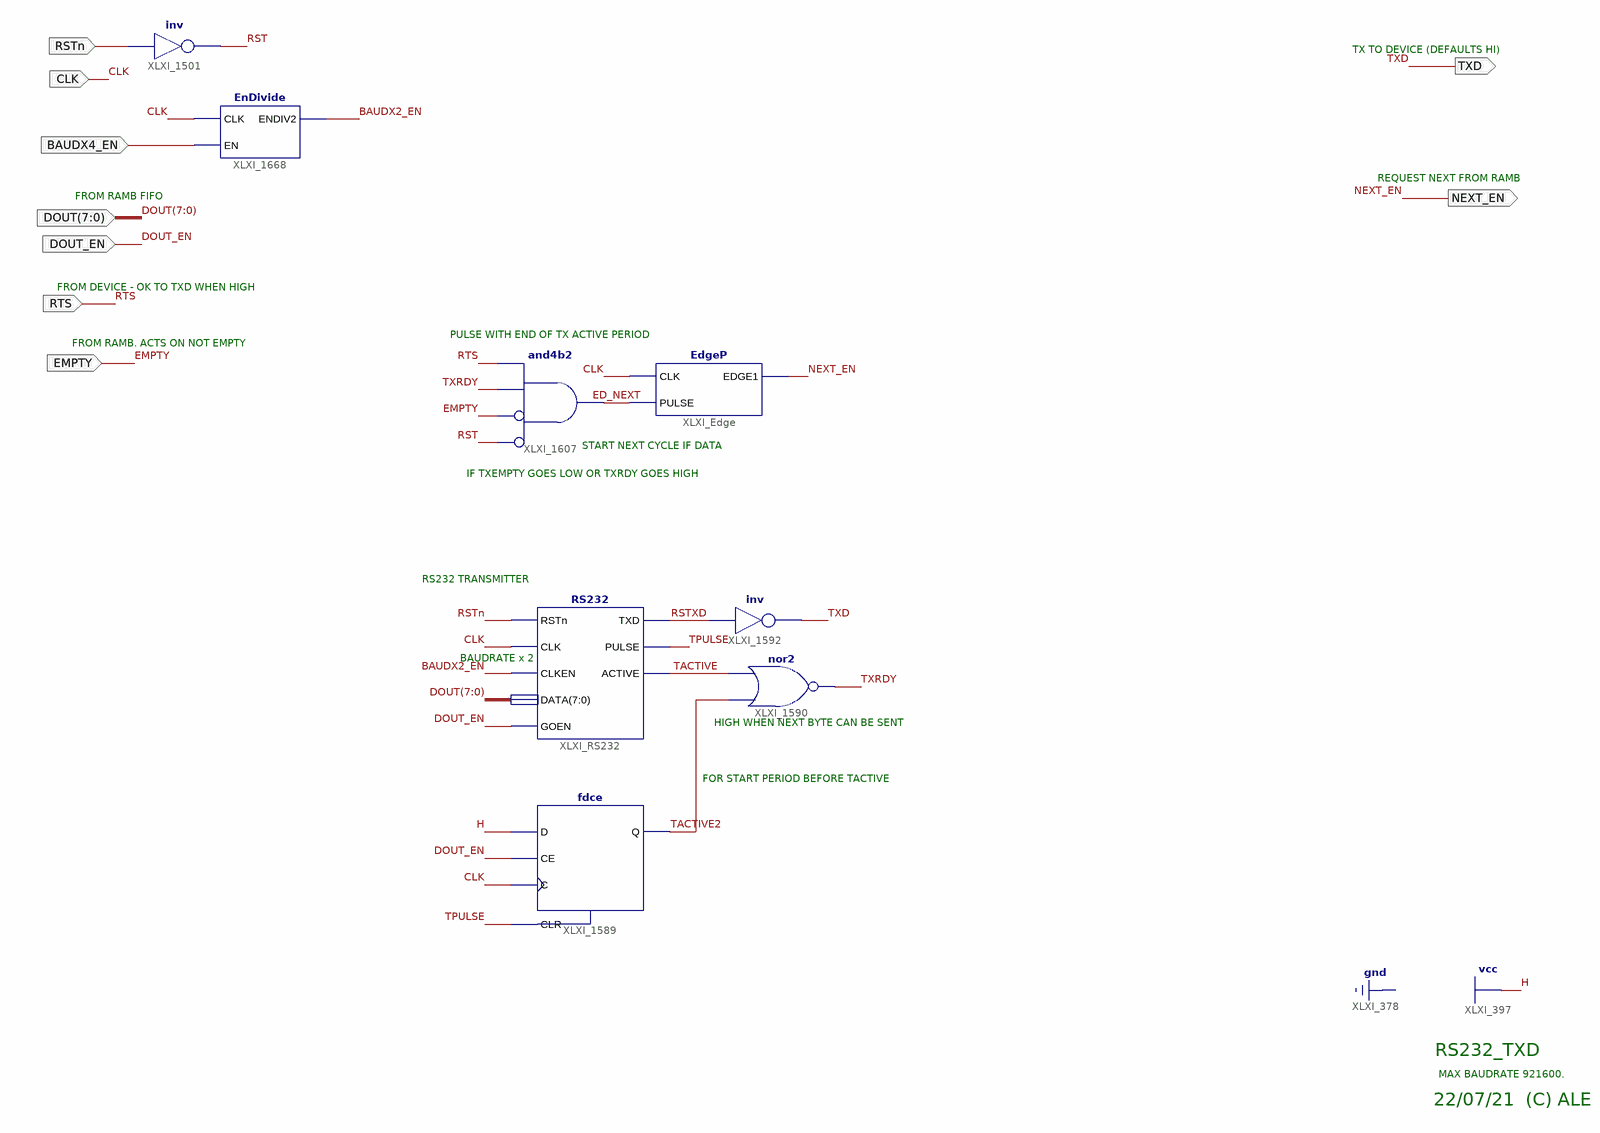
[diagram p0: schematic sheet 1]
// Xilinx ISE schematic RS232_TXD.sch (spartan3e) as structural Verilog: 8 symbols, 9 ports
module RS232_TXD (
  input  CLK,
  input  RSTn,
  input  RTS,
  input  [7:0] DOUT,
  input  DOUT_EN,
  input  EMPTY,
  input  BAUDX4_EN,
  output TXD,
  output NEXT_EN
);

  wire BAUDX2_EN, ED_NEXT, RST, RSTXD, TACTIVE, TACTIVE2, TPULSE, TXRDY;

  not XLXI_1501 (RST, RSTn);
  nor XLXI_1590 (TXRDY, TACTIVE2, TACTIVE);
  not XLXI_1592 (TXD, RSTXD);
  fdce XLXI_1589 (.C(CLK), .CE(DOUT_EN), .CLR(TPULSE), .D(1'b1), .Q(TACTIVE2));
  RS232 XLXI_RS232 (
    .ACTIVE(TACTIVE), .CLK(CLK), .CLKEN(BAUDX2_EN), .DATA(DOUT), .GOEN(DOUT_EN), .PULSE(TPULSE), .RSTn(RSTn),
    .TXD(RSTXD));
  EdgeP XLXI_Edge (.CLK(CLK), .EDGE1(NEXT_EN), .PULSE(ED_NEXT));
  and XLXI_1607 (ED_NEXT, ~RST, ~EMPTY, TXRDY, RTS);  // and4b2
  EnDivide XLXI_1668 (.CLK(CLK), .EN(BAUDX4_EN), .ENDIV2(BAUDX2_EN));

  // Notes on the sheet:
  //   TX TO DEVICE (DEFAULTS HI)
  //   REQUEST NEXT FROM RAMB
  //   FROM RAMB FIFO
  //   FROM DEVICE - OK TO TXD WHEN HIGH
  //   PULSE WITH END OF TX ACTIVE PERIOD
  //   FROM RAMB. ACTS ON NOT EMPTY
  //   START NEXT CYCLE IF DATA
  //   IF TXEMPTY GOES LOW OR TXRDY GOES HIGH
  //   RS232 TRANSMITTER
  //   BAUDRATE x 2
  //   HIGH WHEN NEXT BYTE CAN BE SENT
  //   FOR START PERIOD BEFORE TACTIVE
  //   RS232_TXD
  //   MAX BAUDRATE 921600.
  //   22/07/21  (C) ALE
endmodule
